# Altium schematic sheet Analizador_de_espectro.SchDoc: Analizador_de_Espectro_SCH
size A4; Date: 09/09/2017; Author: Hojnadel - Salazar Ato; Organization: UTN.FRBA; Revision: Rev1.0; SheetNumber: 1; SheetTotal: 6
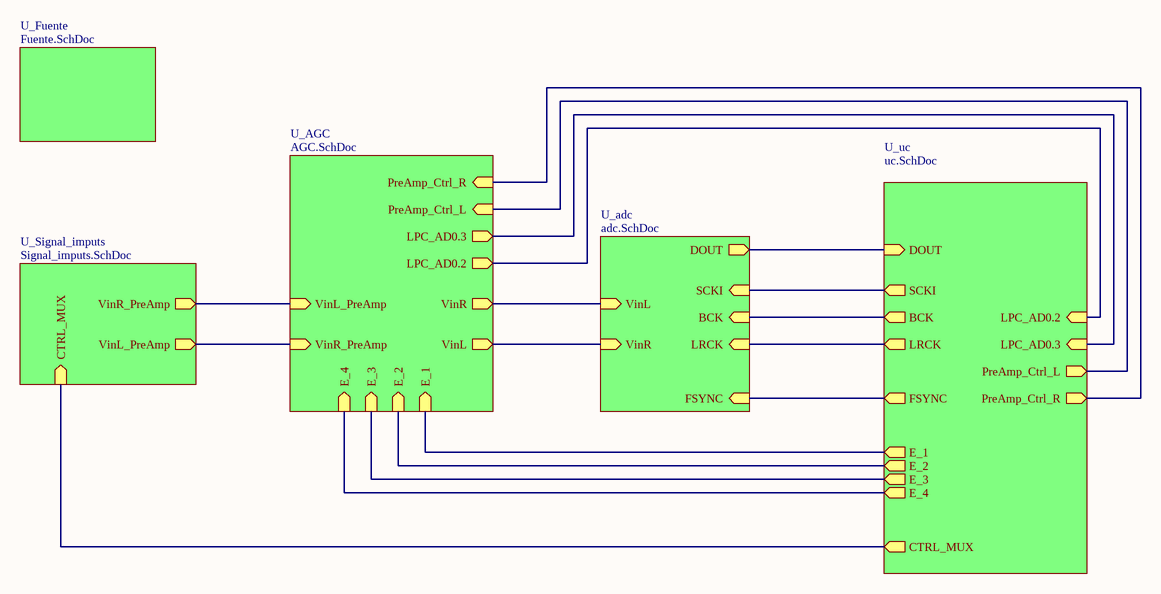
[diagram p0: Analizador_de_espectro.SchDoc]

## Sub-sheets
U_adc = adc.SchDoc: SCKI (in), DOUT (out), BCK (in), LRCK (in), FSYNC (in), VinL (in), VinR (in)
U_AGC = AGC.SchDoc: VinR (out), VinL (out), VinL_PreAmp (in), VinR_PreAmp (in), E_1 (in), E_2 (in), E_3 (in), E_4 (in), PreAmp_Ctrl_L (in), PreAmp_Ctrl_R (in), LPC_AD0.3 (out), LPC_AD0.2 (out)
U_Fuente = Fuente.SchDoc: no entries
U_Signal_imputs = Signal_imputs.SchDoc: CTRL_MUX (in), VinR_PreAmp (out), VinL_PreAmp (out)
U_uc = uc.SchDoc: DOUT (in), BCK (out), LRCK (out), SCKI (out), FSYNC (out), CTRL_MUX (out), E_2 (out), E_3 (out), E_1 (out), E_4 (out), PreAmp_Ctrl_L (out), PreAmp_Ctrl_R (out), LPC_AD0.3 (in), LPC_AD0.2 (in)

## Nets
(unnamed): sheet U_adc/SCKI, sheet U_uc/SCKI
(unnamed): sheet U_adc/DOUT, sheet U_uc/DOUT
(unnamed): sheet U_adc/BCK, sheet U_uc/BCK
(unnamed): sheet U_adc/LRCK, sheet U_uc/LRCK
(unnamed): sheet U_adc/FSYNC, sheet U_uc/FSYNC
(unnamed): sheet U_adc/VinL, sheet U_AGC/VinR
(unnamed): sheet U_adc/VinR, sheet U_AGC/VinL
(unnamed): sheet U_uc/CTRL_MUX, sheet U_Signal_imputs/CTRL_MUX
(unnamed): sheet U_uc/E_2, sheet U_AGC/E_2
(unnamed): sheet U_uc/E_3, sheet U_AGC/E_3
(unnamed): sheet U_uc/E_1, sheet U_AGC/E_1
(unnamed): sheet U_uc/E_4, sheet U_AGC/E_4
(unnamed): sheet U_uc/PreAmp_Ctrl_L, sheet U_AGC/PreAmp_Ctrl_L
(unnamed): sheet U_uc/PreAmp_Ctrl_R, sheet U_AGC/PreAmp_Ctrl_R
(unnamed): sheet U_uc/LPC_AD0.3, sheet U_AGC/LPC_AD0.3
(unnamed): sheet U_uc/LPC_AD0.2, sheet U_AGC/LPC_AD0.2
(unnamed): sheet U_AGC/VinL_PreAmp, sheet U_Signal_imputs/VinR_PreAmp
(unnamed): sheet U_AGC/VinR_PreAmp, sheet U_Signal_imputs/VinL_PreAmp